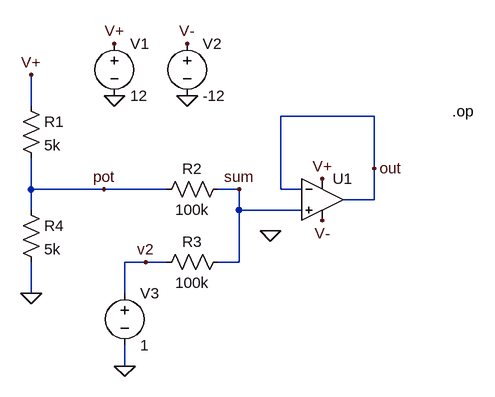
[diagram p0: schematic Draft1.asc]
Draft1.asc, the LTspice schematic file:
Version 4
SHEET 1 904 680
WIRE -224 16 -224 -32
WIRE 304 32 160 32
WIRE 304 112 304 32
WIRE -224 144 -224 96
WIRE -112 144 -224 144
WIRE -16 144 -112 144
WIRE 96 144 64 144
WIRE 160 144 160 32
WIRE 192 144 160 144
WIRE 304 160 304 112
WIRE 304 160 256 160
WIRE -224 176 -224 144
WIRE 96 176 96 144
WIRE 192 176 96 176
WIRE -48 256 -80 256
WIRE -16 256 -48 256
WIRE 96 256 96 176
WIRE 96 256 64 256
WIRE -224 304 -224 256
WIRE -80 304 -80 256
WIRE -80 416 -80 384
FLAG -96 0 0
FLAG 16 0 0
FLAG -96 -80 V+
FLAG 16 -80 V-
FLAG 224 128 V+
FLAG 224 192 V-
FLAG 144 208 0
FLAG -224 304 0
FLAG -80 416 0
FLAG -224 -32 V+
FLAG -112 144 pot
FLAG 304 112 out
FLAG 96 144 sum
FLAG -48 256 v2
SYMBOL OpAmps\\UniversalOpamp2 224 160 R0
SYMATTR InstName U1
SYMBOL voltage -96 -96 R0
WINDOW 123 0 0 Left 0
WINDOW 39 0 0 Left 0
SYMATTR InstName V1
SYMATTR Value 12
SYMBOL voltage 16 -96 R0
WINDOW 123 0 0 Left 0
WINDOW 39 0 0 Left 0
SYMATTR InstName V2
SYMATTR Value -12
SYMBOL res 80 128 R90
WINDOW 0 0 56 VBottom 2
WINDOW 3 32 56 VTop 2
SYMATTR InstName R2
SYMATTR Value 100k
SYMBOL res 80 240 R90
WINDOW 0 0 56 VBottom 2
WINDOW 3 32 56 VTop 2
SYMATTR InstName R3
SYMATTR Value 100k
SYMBOL res -240 0 R0
SYMATTR InstName R1
SYMATTR Value 5k
SYMBOL res -240 160 R0
SYMATTR InstName R4
SYMATTR Value 5k
SYMBOL voltage -80 288 R0
WINDOW 123 0 0 Left 0
WINDOW 39 0 0 Left 0
SYMATTR InstName V3
SYMATTR Value 1
TEXT 424 24 Left 2 !.op

The netlist it stands for:
* Draft1.asc
XU1 sum out V+ V- out level.2 Avol=1Meg GBW=10Meg Slew=10Meg ilimit=25m rail=0 Vos=0 phimargin=45 en=0 enk=0 in=0 ink=0 Rin=500Meg  ; pins IN+ IN- V+ V- OUT
V1 V+ 0 12
V2 V- 0 -12
R2 sum pot 100k
R3 sum v2 100k
R1 V+ pot 5k
R4 pot 0 5k
V3 v2 0 1
.op
.lib UniversalOpamps2.sub
.backanno
.end